# Altium schematic sheet supply.SchDoc
size A3; Hw_rev: 0; License: GPLv3; Address3: Firenze; Address4: ITALY; DocumentNumber: 2; Revision: 0; SheetNumber: 2; SheetTotal: 8
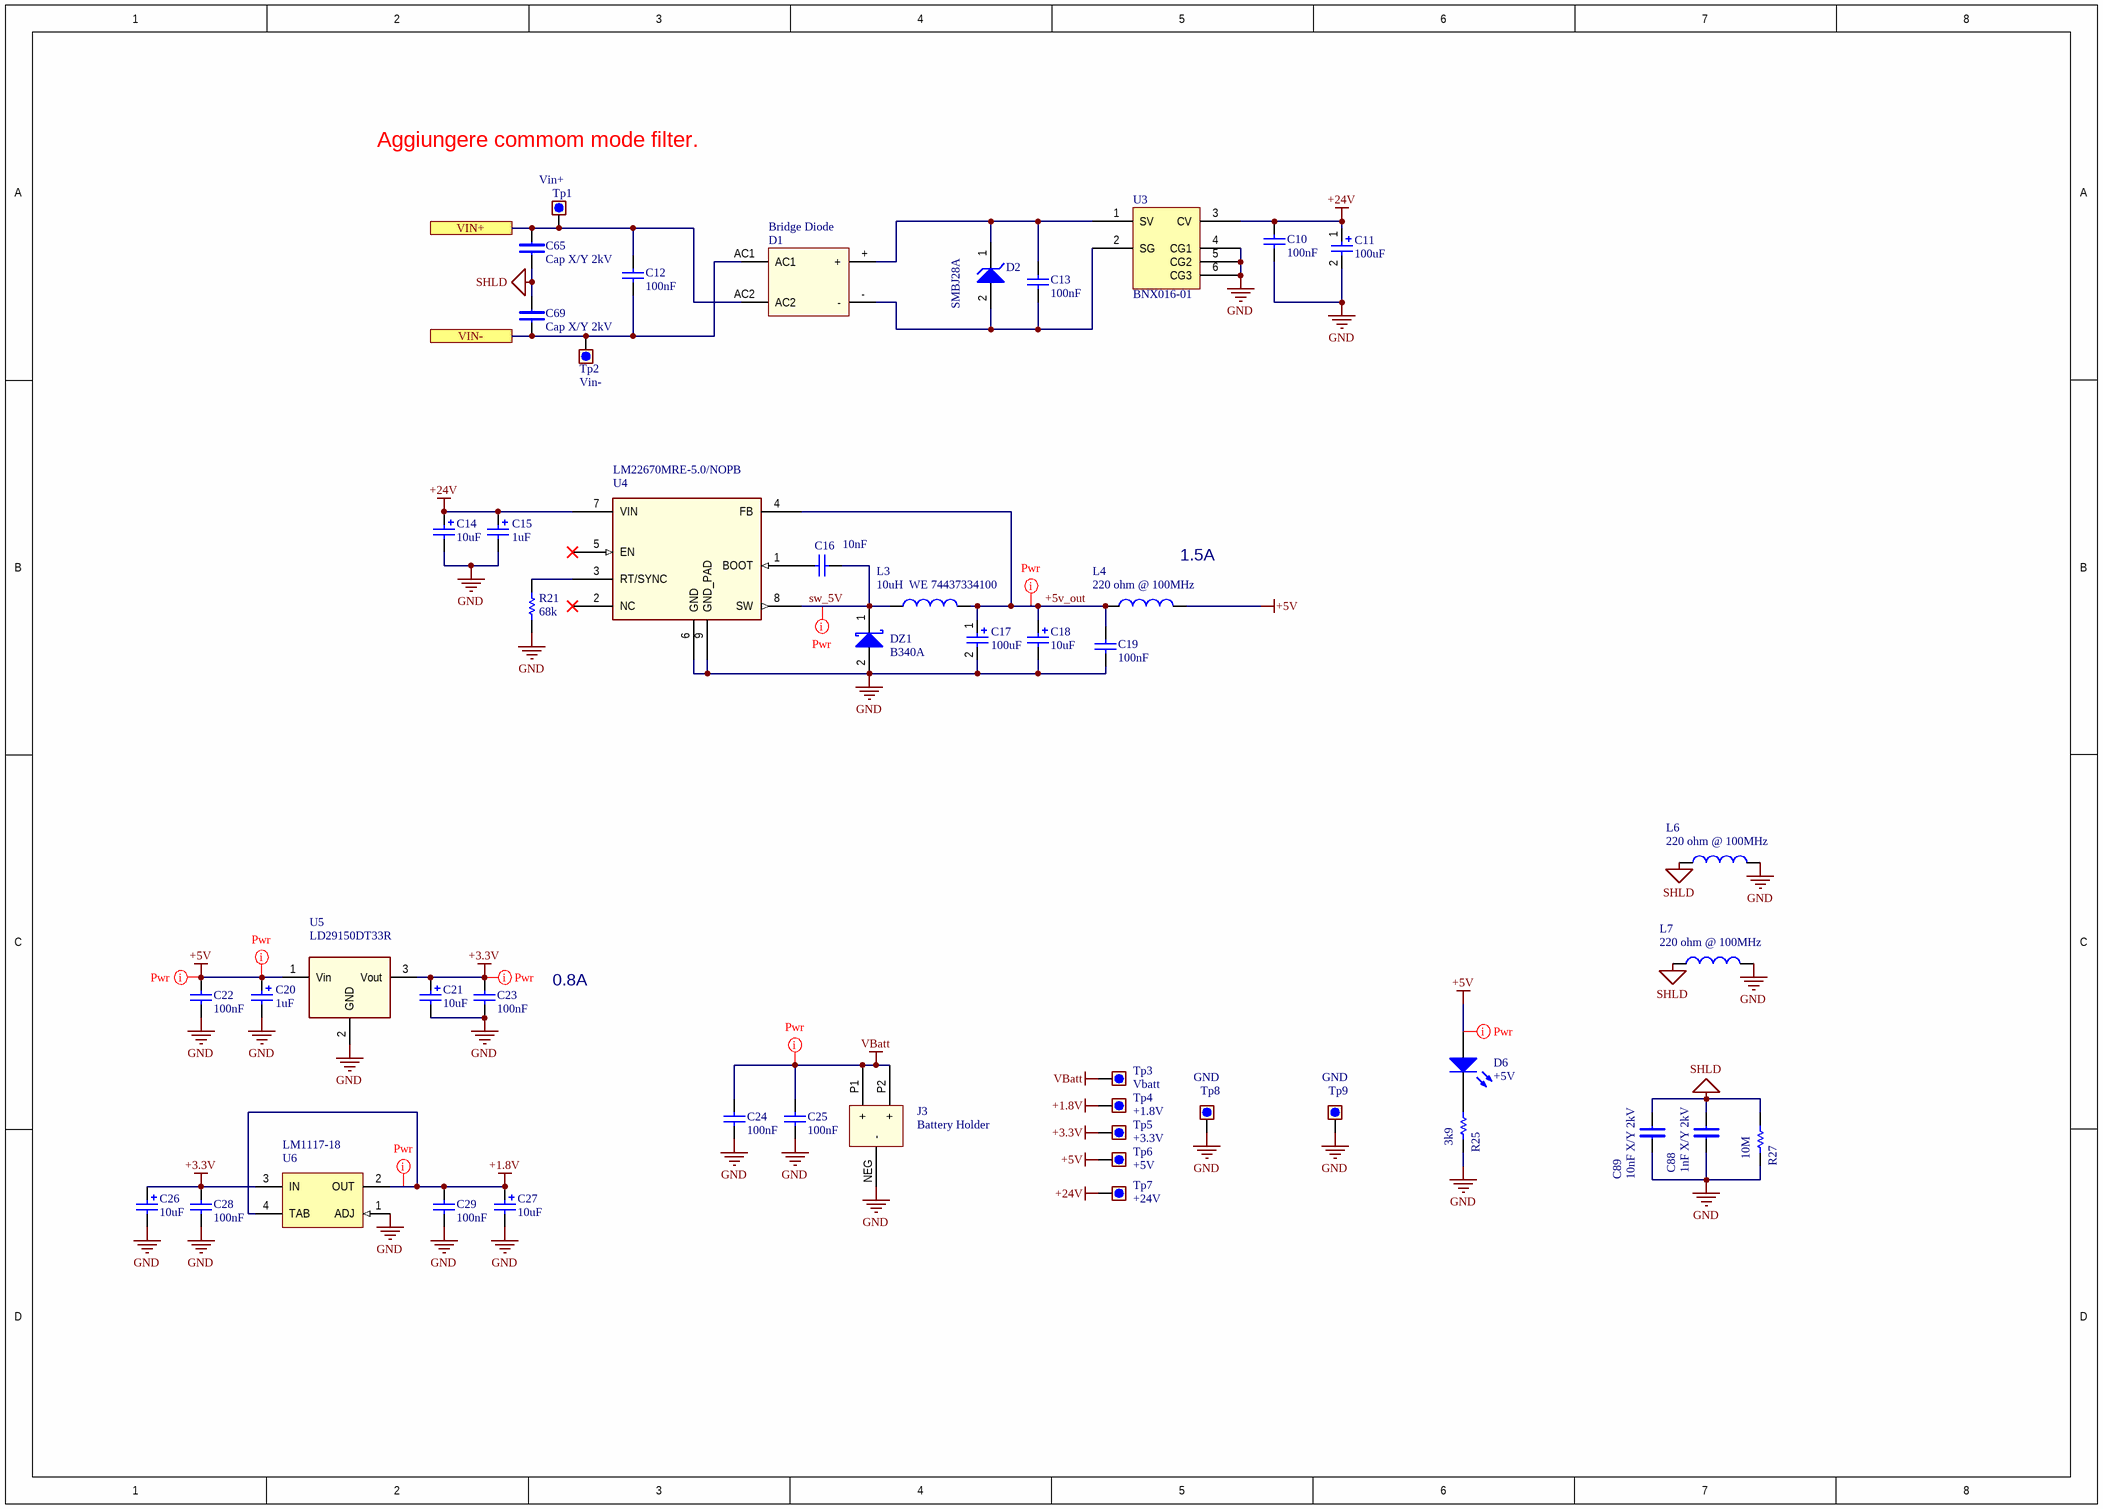
[diagram p0: supply.SchDoc]

## Parts
C10  100nF  [0603_[1608]]
C11  100uF  [CAP_6x6_D8_SMD]
C12  100nF  [0603_[1608]]
C13  100nF  [0603_[1608]]
C14  10uF  [1206_[3216]]
C15  1uF  [0805_[2012]]
C16  10nF  [0603_[1608]]
C17  100uF  [[7343]_CAP_TAN]
C18  10uF  [1206_[3216]]
C19  100nF  [0603_[1608]]
C20  1uF  [0805_[2012]]
C21  10uF  [1206_[3216]]
C22  100nF  [0603_[1608]]
C23  100nF  [0603_[1608]]
C24  100nF  [0603_[1608]]
C25  100nF  [0603_[1608]]
C26  10uF  [1206_[3216]]
C27  10uF  [1206_[3216]]
C28  100nF  [0603_[1608]]
C29  100nF  [0603_[1608]]
C65  Cap X/Y 2kV  [1808_[4520]]
C69  Cap X/Y 2kV  [1808_[4520]]
C88  1nF X/Y 2kV  [1808_[4520]]
C89  10nF X/Y 2kV  [2220_[5650]]
D1  Bridge Diode  [Diode_bridge_smd]
D2  SMBJ28A  [DO214AA_K1-A2_SMB]
D6  +5V  [0603_[1608]_K2-A1_LED]
DZ1  B340A  [DO214AA_K1-A2_SMB]
J3  Battery Holder  [Battery_holder_16mm_thd]
L3  10uH  WE 74437334100  [WE-LHMI_5020]
L4  220 ohm @ 100MHz  [0805_[2012]]
L6  220 ohm @ 100MHz  [0805_[2012]]
L7  220 ohm @ 100MHz  [0805_[2012]]
R21  68k  [0603_[1608]]
R25  3k9  [0603_[1608]]
R27  10M  [1206_[3216]]
Tp1  Vin+  [TEST_POINT_THD_D1.8MM]  (no BOM)
Tp2  Vin-  [TEST_POINT_THD_D1.8MM]  (no BOM)
Tp3  Vbatt  [TEST_POINT_THD_D1.8MM]  (no BOM)
Tp4  +1.8V  [TEST_POINT_THD_D1.8MM]  (no BOM)
Tp5  +3.3V  [TEST_POINT_THD_D1.8MM]  (no BOM)
Tp6  +5V  [TEST_POINT_THD_D1.8MM]  (no BOM)
Tp7  +24V  [TEST_POINT_THD_D1.8MM]  (no BOM)
Tp8  GND  [TEST_POINT_THD_D1.8MM]  (no BOM)
Tp9  GND  [TEST_POINT_THD_D1.8MM]  (no BOM)
U3  BNX016-01  [BNX001]
U4  LM22670MRE-5.0/NOPB  [SOIC8_PAD]
U5  LD29150DT33R  [TO-252_D2PAK_LARGEPAD]
U6  LM1117-18  [SOT-223]

## Ports
VIN+, VIN-

## Nets
+1.8V: C27.1 C29.2 Tp4.1 U6.2(OUT) U6.4(TAB)
+3.3V: C21.1 C23.2 C26.1 C28.2 Tp5.1 U5.3(Vout) U6.3(IN)
+5V: C20.1 C22.2 D6.1(A) L4.1 Tp6.1 U5.1(Vin)
+24V: C10.2 C11.1 C14.1 C15.1 Tp7.1 U3.3(CV) U4.7(VIN)
GND: C10.1 C11.2 C14.2 C15.2 C17.2 C18.2 C19.1 C20.2 C21.2 C22.1 C23.1 C24.1 C25.1 C26.2 C27.2 C28.1 C29.1 C88.2 C89.2 DZ1.2(A) J3.NEG(-) L6.1 L7.1 R21.1 R25.1 R27.1 Tp8.1 Tp9.1 U3.4(CG1) U3.5(CG2) U3.6(CG3) U4.6(GND) U4.9(GND_PAD) U5.2(GND) U6.1(ADJ)
SHLD: C65.2 C69.1 C88.1 C89.1 L6.2 L7.2 R27.2
VBatt: C24.2 C25.2 J3.P1(+) J3.P2(+) Tp3.1
+5v_out: C17.1 C18.1 C19.2 L3.2 L4.2 U4.4(FB)
sw_5V: C16.2 DZ1.1(K) L3.1 U4.8(SW)
VIN+: C12.2 C65.1 D1.AC2 Tp1.1 ; port VIN+
VIN-: C12.1 C69.2 D1.AC1 Tp2.1 ; port VIN-
NetC13_1: C13.1 D1.- D2.2(A) U3.2(SG)
NetC13_2: C13.2 D1.+ D2.1(K) U3.1(SV)
NetC16_1: C16.1 U4.1(BOOT)
NetD6_2: D6.2(K) R25.2
NetR21_2: R21.2 U4.3(RT/SYNC)

Not connected (* = marked no-connect by the designer): U4 2(NC)* 5(EN)*

## Layout directives
net class Power: +1.8V, +3.3V, +5V, +5v_out, sw_5V, VBatt

## Notes on the sheet
- Aggiungere commom mode filter.
- (near L4) 1.5A
- 0.8A

## Library data of the parts
C10 C12 C13 C16 C19 C22-C25 C28 C29 = Cap: Ceramic X7R 50V; Value: 100pF; Published: 8-Jun-2000; LatestRevisionDate: 17-Jul-2002; LatestRevisionNote: Re-released for DXP Platform.; PackageReference: RAD-0.3; Publisher: Altium Limited; PackageDescription: Radial Cap, Thru-Hole; 2 Leads; 0.3 in Pin Spacing
C11 = Cap Pol1: EEEFK1H101P SMT 6x6 35V; Value: 10uF; Published: 8-Jun-2000; Revision: July-2002: Re-released for DXP Platform.; Publisher: Altium Limited
C14 C18 C21 C26 C27 = Cap Pol1: Ceramic X5R 25V; Published: 8-Jun-2000; Revision: July-2002: Re-released for DXP Platform.; Publisher: Altium Limited; Value: 10uF
C15 C20 = Cap Pol1: Ceramic X7R 50V; Value: 10uF; Published: 8-Jun-2000; Revision: July-2002: Re-released for DXP Platform.; Publisher: Altium Limited
C17 = Cap Pol1: Tantalum 10V (T495D107K010ATE100); Value: 10uF; Published: 8-Jun-2000; Revision: July-2002: Re-released for DXP Platform.; Publisher: Altium Limited
C65 C69 = cap_xy: Ceramic 1nF 1808 250VAC X7R X1/Y1 (Murata GA342DR7GF102KW)
C88 = cap_xy: Ceramic 250VAC X7R X1/Y1 (GA342DR7GF102KW)
C89 = cap_xy: Ceramic 250VAC X7R X1/Y1 (GA355DR7GB103KY02L)
D1 = Diode_bridge2: MBS4 (Farnell cod:4084985)
D2 = D Zener: TVS Monodirectional; Published: 8-Jun-2000; LatestRevisionDate: 17-Jul-2002; LatestRevisionNote: Re-released for DXP Platform.; PackageReference: DIODE-0.7; Publisher: Altium Limited; PackageDescription: Diode, Thru-Hole; 2 Leads; 0.7 in Pin Spacing
D6 = LED0: LED Green; Published: 8-Jun-2000; LatestRevisionDate: 08-Jul-2005; LatestRevisionNote: Mech Layer 1 removed.; PackageReference: LED-0; Publisher: Altium Limited; PackageDescription: LED; 2 Leads
DZ1 = D Schottky: Diode Schottky (STPS2L40U); Published: 8-Jun-2000; LatestRevisionDate: 17-Jul-2002; LatestRevisionNote: Re-released for DXP Platform.; PackageReference: SMB; Publisher: Altium Limited; PackageDescription: DO-214-AA/SMB; 2 C-Bend Leads; Body 5.3 x 3.6 mm, inc. leads (LxW); Code_JEDEC: DO-214-AA
J3 = Battery_holder_3002: CR1612/1616/1620/1632 (3013, Keystone)
L3 = Inductor: SMD Shielded Tiny Power Inductor; Code_IEC: 1005; Value: 10mH; Published: 8-Jun-2000; LatestRevisionDate: 29-May-2009; LatestRevisionNote: IPC-7351 Footprint Added.; PackageReference: 0402-A; Publisher: Altium Limited; PackageDescription: Chip Inductor; Code_JEITA: 0402
L4 L6 L7 = Inductor: WE 742792022
R21 R25 R27 = Res1: Resistor; Revision: July-2002: Re-released for DXP Platform.
Tp1-Tp9 = Test_point: Test point
U3 = BNX002: EMI Filter DC power line
U4 = LM22670MR-ADJ: Power switch
U5 = LD29150DT33R: Very Low Drop Linear regulator 3.3V (BA33BC0FP-E2; MIC2940A-3.3WU)
U6 = LM317AEMP: LDO, Fixed Vout = 1.8V; Manufacturer: National Semiconductor; PackageTopMarking: XYTT*N07A; PowerWise: N; CompType: LDO IC; Published: 4-Dec-2008; DatasheetVersion: Apr-2007; PackageVersion: revB, Apr-2003; PackageReference: MP04A; Publisher: Altium Limited; PackageDescription: Molded SOT-223, 6.50 x 3.56 x 1.6mm Body, 4 Lead, 2.3mm Pitch; Supplier 1: Farnell; Supplier Part Number 1: 9779272RL; Supplier 2: Farnell; Supplier Part Number 2: 9779272; PartNumber: LM317AEMP; RoHS: N; PinCount: 4; Code_JEDEC: TO-261-AA; Code_IPC: SOT223-4; ComponentLink1Description: LM317 Datasheet; ComponentLink1URL: http://www.national.com/ds/LM/LM317.pdf; ComponentLink2Description: LM317 Web Page; ComponentLink2URL: http://www.national.com/pf/LM/LM317.html; ComponentLink3Description: MP04A Package Page; ComponentLink3URL: http://www.national.com/packaging/folders/mp04a.html